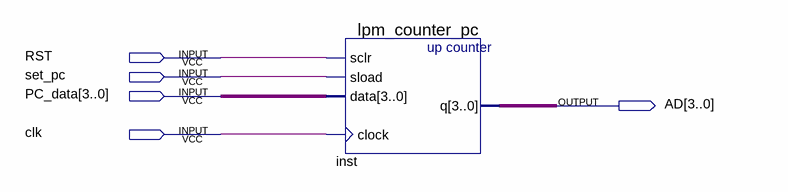
[diagram p0: schematic sheet]
// Quartus schematic PC.bdf as structural Verilog: 1 symbols, 5 pins
module PC (
  input  RST,
  input  set_pc,
  input  [3:0] PC_data,
  input  clk,
  output [3:0] AD
);

  lpm_counter_pc inst (.sclr(RST), .sload(set_pc), .data(PC_data), .clock(clk), .q(AD));
endmodule
